# EAGLE design unoshield-v6 (EAGLE 9.6.2)
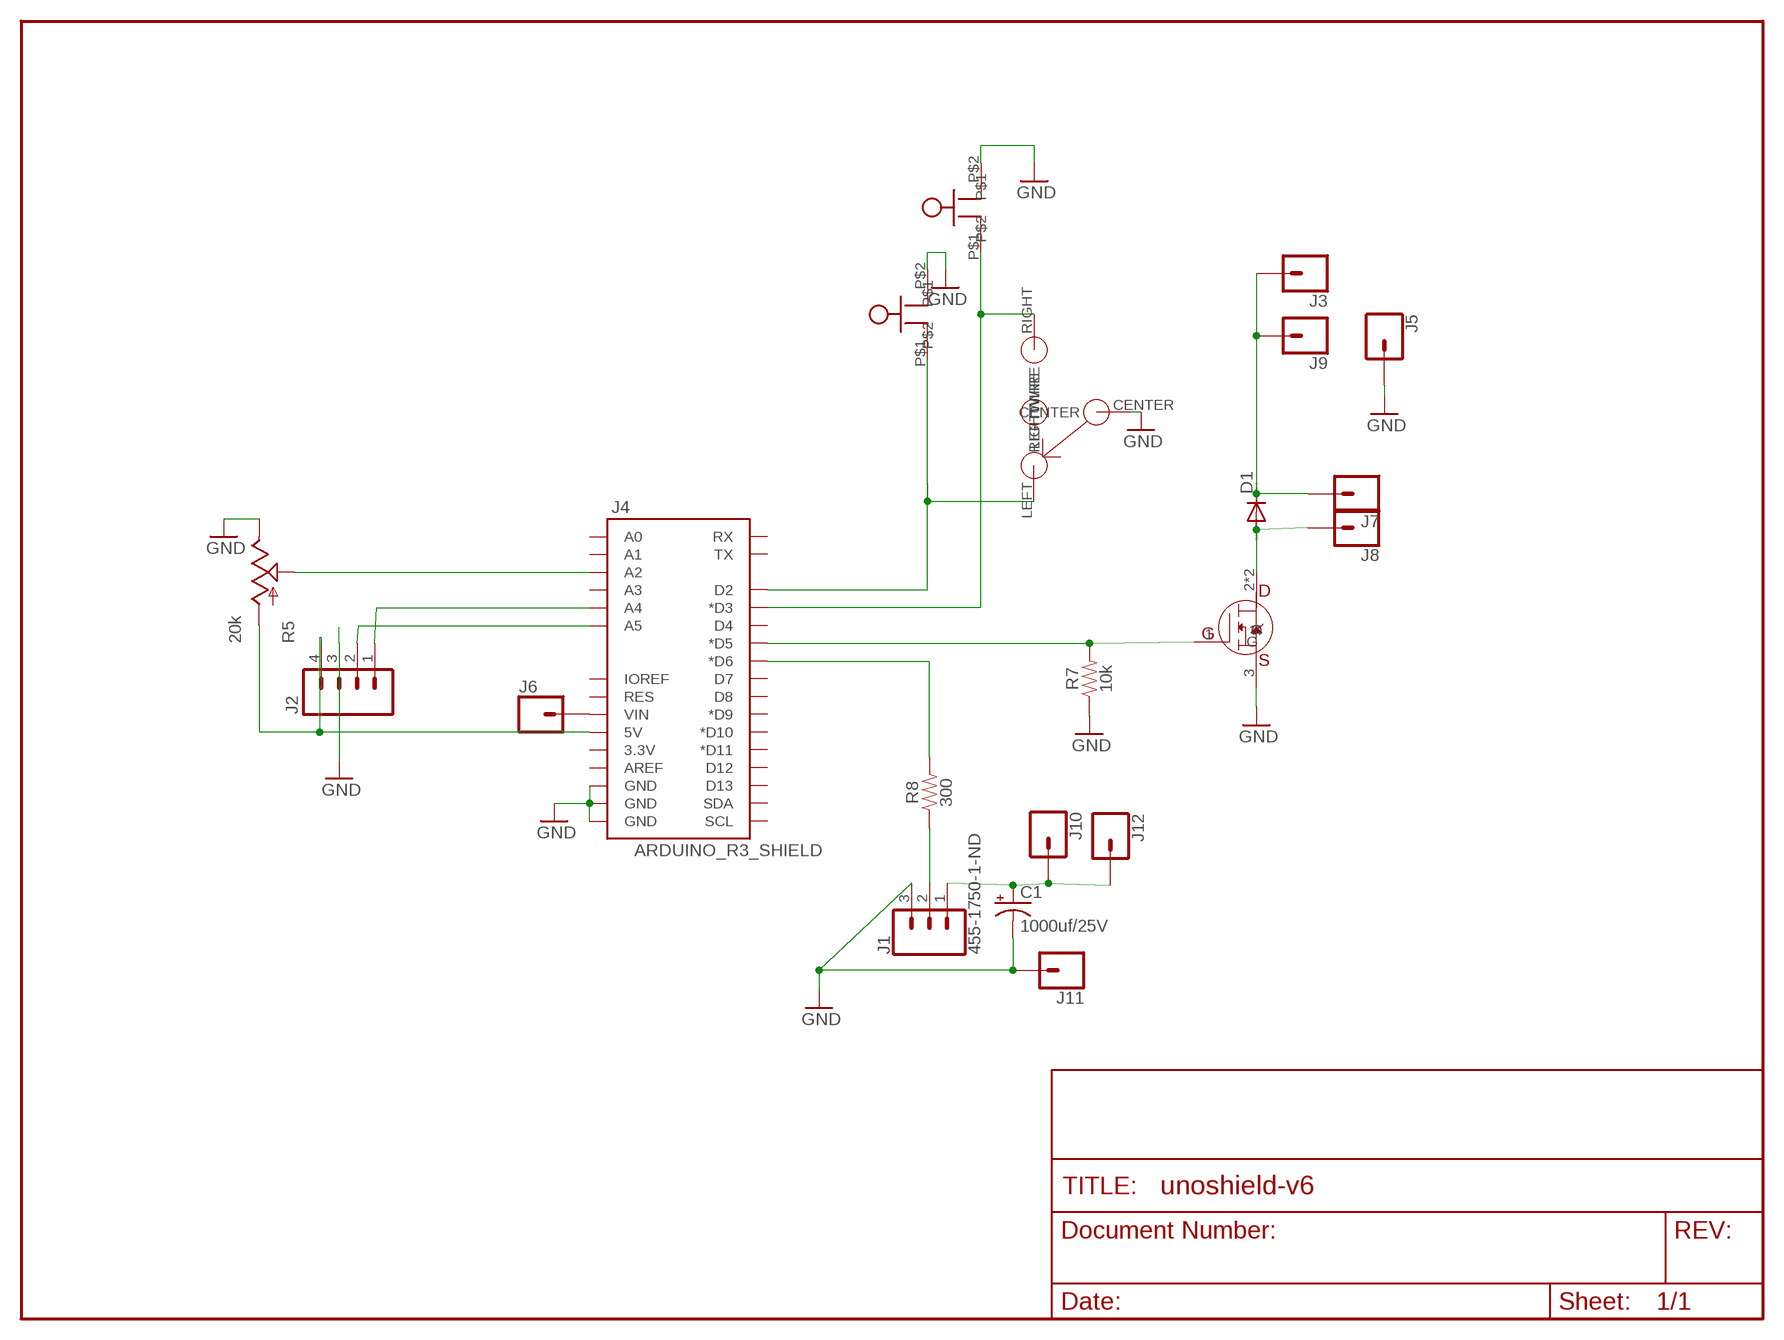
[diagram p0: schematic, sheet 1]

## Parts
C1  1000uf/25V  1000UF-25V(PTH)KIT  [CPOL-RADIAL-1000UF-25V-KIT]
D1  DIODE-DO-214AC  [DO-214AC]
J1  455-1750-1-ND  CONN_03  [1X03]
J2  M04PTH  [1X04]
J3  CONN_01PTH_2MM  [1X01_2MM]
J4  ARDUINO_R3_SHIELD  [UNO_R3_SHIELD]
J5  CONN_01PTH_2MM  [1X01_2MM]
J6  CONN_01  [1X01]
J7  CONN_01PTH_2MM  [1X01_2MM]
J8  CONN_01PTH_2MM  [1X01_2MM]
J9  CONN_01  [1X01]
J10  CONN_01PTH_2MM  [1X01_2MM]
J11  CONN_01PTH_2MM  [1X01_2MM]
J12  CONN_01  [1X01]
R5  20k  POTALPS-KIT  [ALPS_POT_KIT]
R7  10k  10KOHM-HORIZ-1/4W-1%  [AXIAL-0.3]
R8  300  1KOHM-HORIZ-1/4W-5%  [AXIAL-0.3]
SW1  BUTTON  [BUTTON]
SW2  BUTTON  [BUTTON]
SW3  ON-OFF-ON-360-1013-ND  [360-1013-ND]
U$1  IRFL024NPBF  [SOT223]

## Nets
BUTTON: J4.D3(*D3) SW2.P$1 SW3.RIGHT(RIGHTWIRE)
CL: J2.2 J4.A5
DA: J2.1 J4.A4
GND: C1.- J1.3 J2.3 J4.GND@0(GND) J4.GND@1(GND) J4.GND@2(GND) J5.1 J11.1 R5.P$1(E) R7.P$1 SW1.P$2 SW2.P$2 SW3.CENTER U$1.3(S)
N$1: J4.D5(*D5) R7.P$2 U$1.1(G)
N$4: J4.D6(*D6) R8.P$2
N$5: J4.VIN J6.1
N$6: C1.+ J1.1 J10.1 J12.1
N$8: D1.A J8.1 U$1.2(D) U$1.4(D)
N$12: J4.D2 SW1.P$1 SW3.LEFT(LEFTWIRE)
N$25: J1.2 R8.P$1
N$28: J4.A2 R5.P$2(S)
VCC: J2.4 J4.5V R5.P$3(A)
VIN: D1.C J3.1 J7.1 J9.1
Unconnected: J4.3.3V J4.A0 J4.A1 J4.A3 J4.AREF J4.D4 J4.D7 J4.D8 J4.D9(*D9) J4.D10(*D10) J4.D11(*D11) J4.D12 J4.D13 J4.IOREF J4.RES J4.RX J4.SCL J4.SDA J4.TX

## Library data of the parts
C1 = SparkFun-Capacitors:1000UF-25V(PTH): CAP-08070; PROD_ID: CAP-09538
D1 = diode:DIODE-: DIODE
J1 = SparkFun-Connectors:CONN_03: Multi connection point. Often used as Generic Header-pin footprint for 0.1 inch spaced/style header connections On any of the 0.1 inch spaced packages, you can populate with these: Break Away Headers - Straight <https://www.sparkfun.com/products/116> (PRT-00116) Break Away Male Headers - Right Angle <https://www.sparkfun.com/products/553> (PRT-00553) Female Headers <https://www.sparkfun.com/products/115> (PRT-00115) Break Away Headers - Machine Pin <https://www.sparkfun.com/products/117> (PRT-00117) Break Away Female Headers - Swiss Machine Pin <https://www.sparkfun.com/products/743> (PRT-00743) Stackable Header - 3 Pin (Female, 0.1") <https://www.sparkfun.com/products/13875> (PRT-13875) For SCREWTERMINALS and SPRING TERMINALS visit here: Screw Terimnals on SparkFun.com <https://www.sparkfun.com/search/results?term=Screw+Terminals> (5mm/3.5mm/2.54mm spacing) This device is also useful as a general connection point to wire up your design to another part of your project. Our various solder wires solder well into these plated through hole pads. Hook-Up Wire - Assortment (Stranded, 22 AWG) <https://www.sparkfun.com/products/11375> (PRT-11375) Hook-Up Wire - Assortment (Solid Core, 22 AWG) <https://www.sparkfun.com/products/11367> (PRT-11367) View the entire wire category on our website here <https://www.sparkfun.com/categories/141> Special notes: Molex polarized connector foot print use with SKU : PRT-08232 with associated crimp pins and housings.; PROD_ID: XXX-00000
J2 = SparkFun-Connectors:M04: Header 4 Standard 4-pin 0.1" header. Use with straight break away headers (SKU : PRT-00116), right angle break away headers (PRT-00553), swiss pins (PRT-00743), machine pins (PRT-00117), and female headers (PRT-00115). Molex polarized connector foot print use with SKU : PRT-08231 with associated crimp pins and housings. 1MM SMD Version SKU: PRT-10208
J3 J5-J12 = SparkFun-Connectors:CONN_01: Single connection point. Often used as Generic Header-pin footprint for 0.1 inch spaced/style header connections On any of the 0.1 inch spaced packages, you can populate with these: Break Away Headers - Straight <https://www.sparkfun.com/products/116> (PRT-00116) Break Away Male Headers - Right Angle <https://www.sparkfun.com/products/553> (PRT-00553) Female Headers <https://www.sparkfun.com/products/115> (PRT-00115) Break Away Headers - Machine Pin <https://www.sparkfun.com/products/117> (PRT-00117) Break Away Female Headers - Swiss Machine Pin <https://www.sparkfun.com/products/743> (PRT-00743) This device is also useful as a general connection point to wire up your design to another part of your project. Our various solder wires solder well into these plated through hole pads. Hook-Up Wire - Assortment (Stranded, 22 AWG) <https://www.sparkfun.com/products/11375> (PRT-11375) Hook-Up Wire - Assortment (Solid Core, 22 AWG) <https://www.sparkfun.com/products/11367> (PRT-11367) View the entire wire category on our website here <https://www.sparkfun.com/categories/141> Special notes: SMTSO-256-ET is a "flush mount" nut for a 4-40 screw. We mostly use this on specialty testbeds; it is a nice way to connect hardware to your PCB at an adjustable hieght. Also note, the SNAP packages are for using a snappable style connector. We sell a baggie of snaps and they are also used on two LilyPad designs: Snap Assortment - 30 pack (male and female) <https://www.sparkfun.com/products/11347> (DEV-11347) LilyPad Arduino SimpleSnap <https://www.sparkfun.com/products/10941> (DEV-10941) LilyPad SimpleSnap Protoboard <https://www.sparkfun.com/products/10940> (DEV-10940)
J4 = SparkFun-Boards:ARDUINO_R3_SHIELD: Shield form compatible with the Arduino Uno R3.
R5 = SparkFun-Electromechanical:POT
R7 = SparkFun-Resistors:10KOHM: 10kΩ resistor A resistor is a passive two-terminal electrical component that implements electrical resistance as a circuit element. Resistors act to reduce current flow, and, at the same time, act to lower voltage levels within circuits. - Wikipedia; PROD_ID: RES-12183
R8 = SparkFun-Resistors:1KOHM: 1kΩ resistor A resistor is a passive two-terminal electrical component that implements electrical resistance as a circuit element. Resistors act to reduce current flow, and, at the same time, act to lower voltage levels within circuits. - Wikipedia; PROD_ID: RES-08380; VALUE: 1k
SW1 SW2 = spietz-library:BUTTON
SW3 = spietz-library:ON-OFF-ON-360-1013-ND
U$1 = spietz-library-2:IRFL024NPBF

## Net classes
0 default: width 0.203 mm
1 vcc: width 0.254 mm

## Board
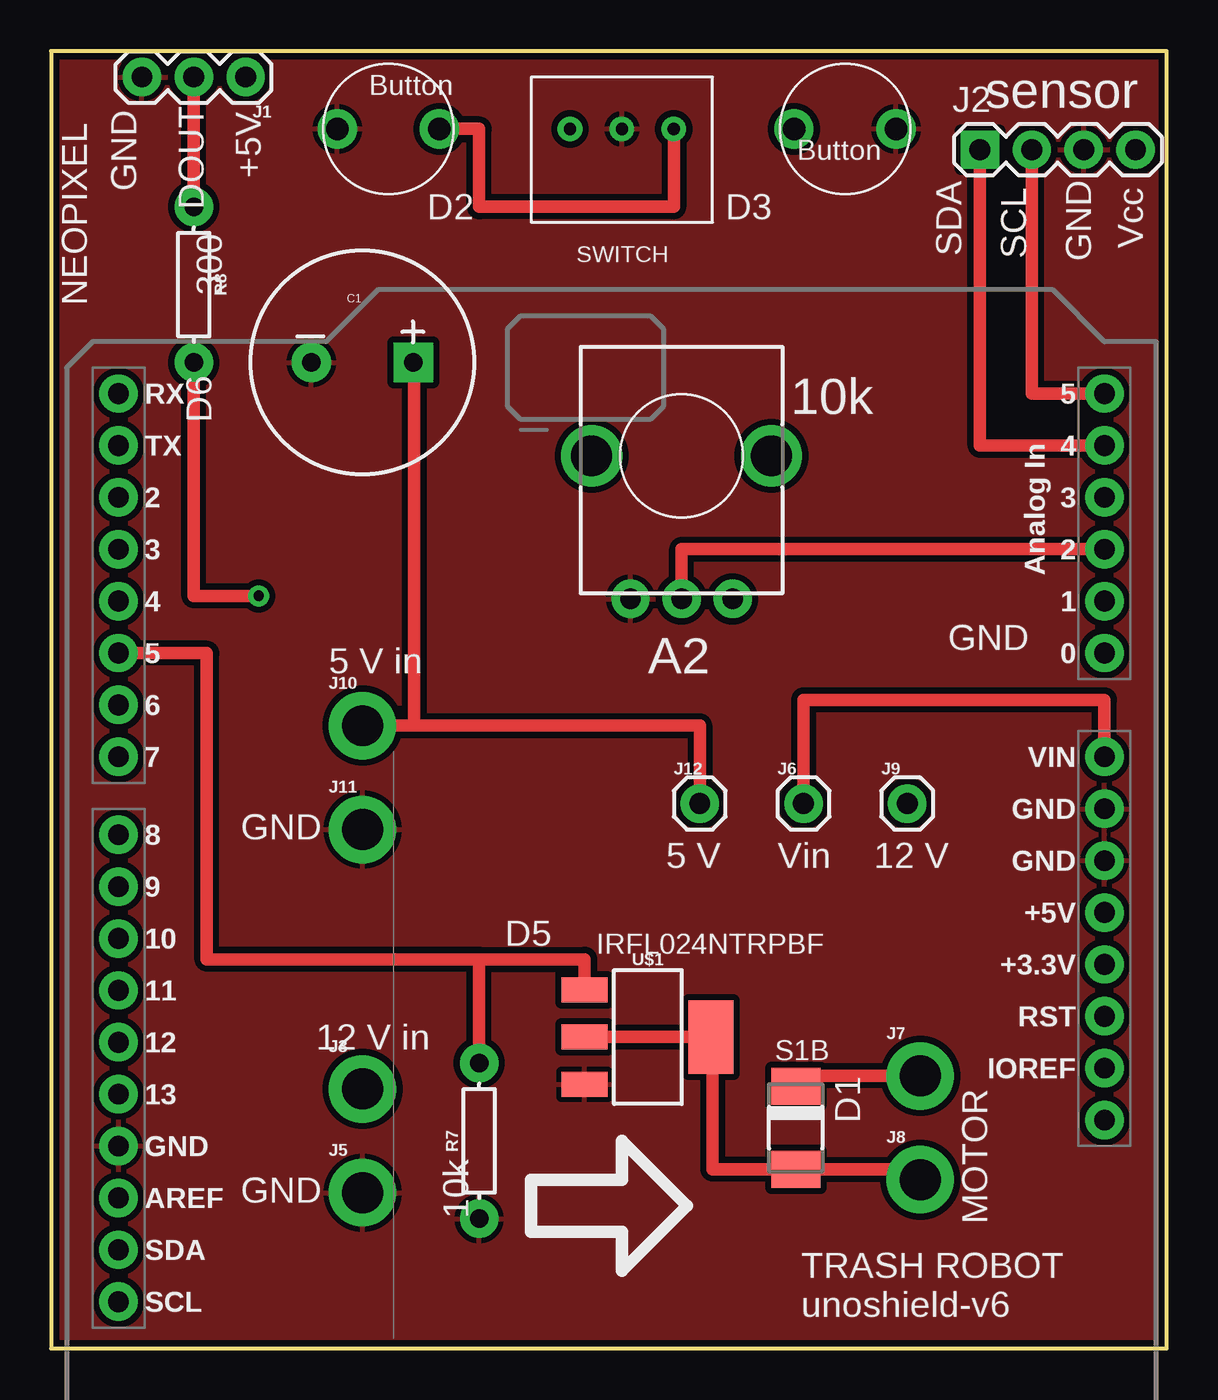
[diagram p1: board, top side]
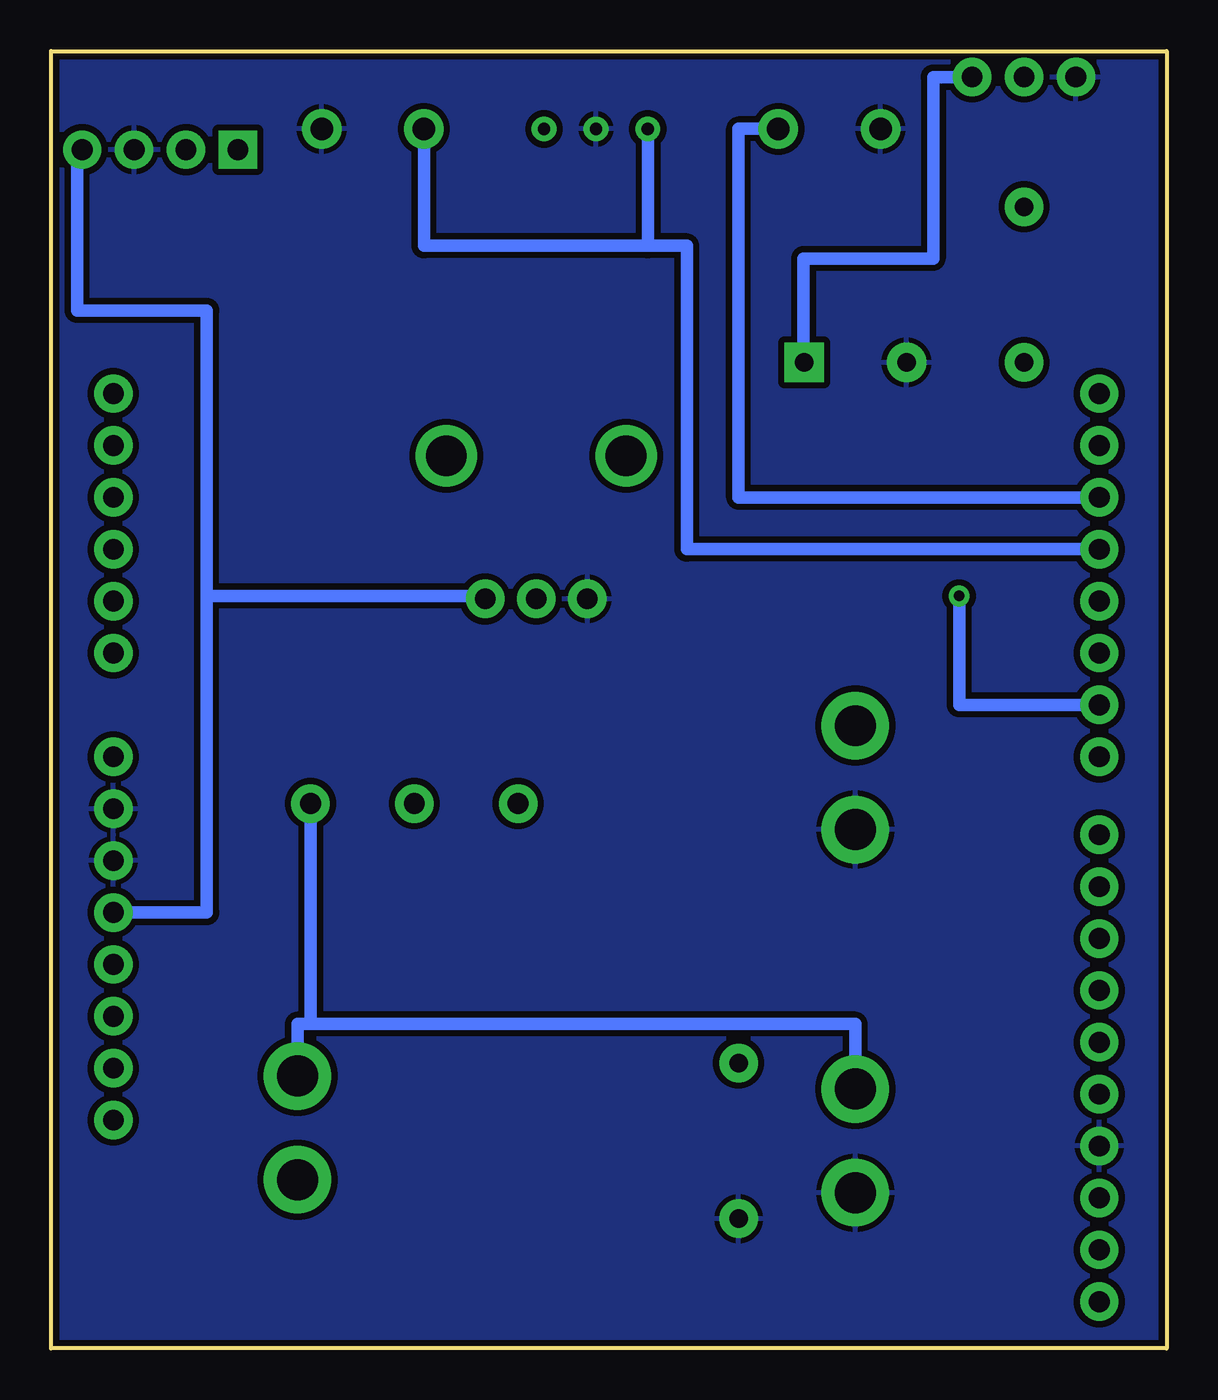
[diagram p2: board, bottom side, seen from below]

Size 54.61 x 63.5 mm. Coordinates in mm from the lower left corner, seen from the top.
Outline: 0,63.5 0,0 54.61,0 54.61,63.5 0,63.5
Copper layers (1*16): Top 0.035mm / dielectric 1.5mm / Bottom 0.035mm
Design rules "default": minimum track width 8mil, minimum drill 20mil, track to track 8mil, track to pad 8mil, pad to pad 8mil, via to via 8mil, smd to smd 8mil, copper to edge 10mil, drill to drill 8mil, minimum pad ring 12mil, minimum via ring 10mil, stop-mask expansion 4mil, vias tented up to drill 25mil, thermal gap 10mil

### Footprints (pad centres in the part's own frame; a part is rotated, then mirrored left to right if it is on the bottom)
CPOL-RADIAL-1000UF-25V-KIT = drill 0.9 pad 1.93 square: + 2.5,0 | drill 0.9 pad 1.93: - -2.5,0
DO-214AC = smd 1.8 x 2.4: A 2.025,0; C -2.025,0
1X03 = drill 1.016 pad 1.88: 1 0,0; 2 2.54,0; 3 5.08,0
1X04 = drill 1.016 pad 1.88 square: 1 0,0 | drill 1.016 pad 1.88: 2 2.54,0; 3 5.08,0; 4 7.62,0
1X01_2MM = drill 2 pad 3.302: 1 0,0
UNO_R3_SHIELD = drill 1.016 pad 1.88: 3.3V 50.8,26.67; 5V 50.8,29.21; A0 50.8,41.91; A1 50.8,44.45; A2 50.8,46.99; A3 50.8,49.53; A4 50.8,52.07; A5 50.8,54.61; AREF 2.54,15.24; D2 2.54,49.53; D3 2.54,46.99; D4 2.54,44.45; D5 2.54,41.91; D6 2.54,39.37; D7 2.54,36.83; D8 2.54,33.02; D9 2.54,30.48; D10 2.54,27.94; D11 2.54,25.4; D12 2.54,22.86; D13 2.54,20.32; GND@0 50.8,31.75; GND@1 50.8,34.29; GND@2 2.54,17.78; IOREF 50.8,21.59; NC 50.8,19.05; RES 50.8,24.13; RX 2.54,54.61; SCL 2.54,10.16; SDA 2.54,12.7; TX 2.54,52.07; VIN 50.8,36.83
1X01 = drill 1.016 pad 1.88: 1 0,0
ALPS_POT_KIT = drill 1 pad 1.88: P$1 7,-2.5; P$2 7,0; P$3 7,2.5 | drill 2: P$4 0,-4.4; P$5 0,4.4
AXIAL-0.3 = drill 0.9 pad 1.88: P$1 -3.81,0; P$2 3.81,0
BUTTON = drill 1.1 pad 1.93: P$1 -2.499,0; P$2 2.499,0
360-1013-ND = drill 0.6: CENTER 0,0; LEFT -2.54,0; RIGHT 2.54,0
SOT223 = smd 1.219 x 2.235: 1 -2.311,-3.099; 2 0,-3.099; 3 2.311,-3.099 | smd 3.6 x 2.2: 4 0,3.099

### Placement (x,y rotation side)
C1  15.24,48.26 0 top
D1  36.45,10.79 270 top
J1  9.53,62.23 180 top
J2  45.47,58.67 0 top
J3  15.24,12.7 0 top
J4  0.76,-7.87 0 top
J5  15.24,7.62 0 top
J6  36.83,26.67 0 top
J7  42.55,13.34 0 top
J8  42.55,8.26 0 top
J9  41.91,26.67 0 top
J10  15.24,30.48 0 top
J11  15.24,25.4 0 top
J12  31.75,26.67 0 top
R5  30.86,43.69 270 top
R7  20.95,10.16 90 top
R8  6.98,52.07 270 top
SW1  16.51,59.69 180 top
SW2  38.86,59.69 0 top
SW3  27.94,59.69 180 top
U$1  29.21,15.24 270 top

### Tracks (layer width: path | path; a pad name or v marks a point on that pad's centre or on a via)
BUTTON
  Bottom 0.61: J4.D3 23.5,39.12 23.5,53.98 25.4,53.98 | SW2.P$1 36.36,53.98 25.4,53.98 | SW3.RIGHT 25.4,53.98
CL
  Top 0.61: 52.07,46.35 51.69,46.74 J4.A5 48.01,46.74 J2.2
  Bottom 0.61: 51.31,46.99 J4.A5
DA
  Top 0.61: J4.A4 45.47,44.2 J2.1
GND
  pour Top (isolate 0.305): -1.27,65.41 55.88,65.41 55.88,-0.64 -1.27,-0.64
  pour Bottom (isolate 0.305): -2.54,67.31 56.52,67.31 56.52,-1.91 -2.54,-1.91
N$1
  Top 0.61: 20.95,19.05 7.62,19.05 7.62,34.04 J4.D5 | 20.95,14.29 R7.P$2 20.95,19.05 | U$1.1 26.11,19.05 20.95,19.05
N$4  (via drill 0.51)
  Top 0.61: R8.P$2 6.98,36.83 v10.16,36.83
  Bottom 0.61: J4.D6 10.16,31.5 v10.16,36.83
N$5
  Top 0.61: 51.56,29.21 J4.VIN 51.56,31.75 36.83,31.75 J6.1
  Bottom 0.61: 51.56,29.21 J4.VIN
N$6
  Top 0.61: J10.1 17.78,30.48 | 17.78,30.48 31.75,30.48 J12.1 | C1.+ 17.78,48.26 17.78,30.48
  Bottom 0.61: J1.1 11.43,62.23 11.43,53.34 17.78,53.34 17.78,48.26 C1.+
N$8
  Top 0.61: J8.1 42.55,8.77 D1.A 32.38,8.77 32.38,15.24 | 32.38,15.24 U$1.4 U$1.2 | 32.38,15.88 32.38,15.24
N$12
  Top 0.61: SW3.LEFT 30.48,55.88 20.95,55.88 20.95,59.69 SW1.P$1
  Bottom 0.61: SW1.P$1 20.95,59.69 20.95,41.66 J4.D2
N$25
  Top 0.61: R8.P$1 J1.2
N$28
  Top 0.61: R5.P$2 30.86,39.12 J4.A2
VCC
  Bottom 0.61: J4.5V 46.99,21.34 46.99,36.83 | J2.4 53.34,58.67 53.34,50.8 46.99,50.8 46.99,36.83 | R5.P$3 33.36,36.83 46.99,36.83
VIN
  Top 0.61: J7.1 36.45,13.34 D1.C
  Bottom 0.61: J7.1 42.55,15.88 41.91,15.88 | J9.1 41.91,15.88 | J3.1 15.24,15.88 41.91,15.88

### Text on the board
tPlace: Button | sensor | Button | GND | +5V | D2 | D3 | DOUT | SWITCH | Vcc | SDA | SCL | GND | 300 | NEOPIXEL | D6 | 10k | GND | 5 V in | A2 | GND | 5 V | Vin | 12 V | D5 | IRFL024NTRPBF | 12 V in | S1B | MOTOR | GND | 10k | TRASH ROBOT / unoshield-v6
tValues: Tent Vias! | Arduino Wee v1.3